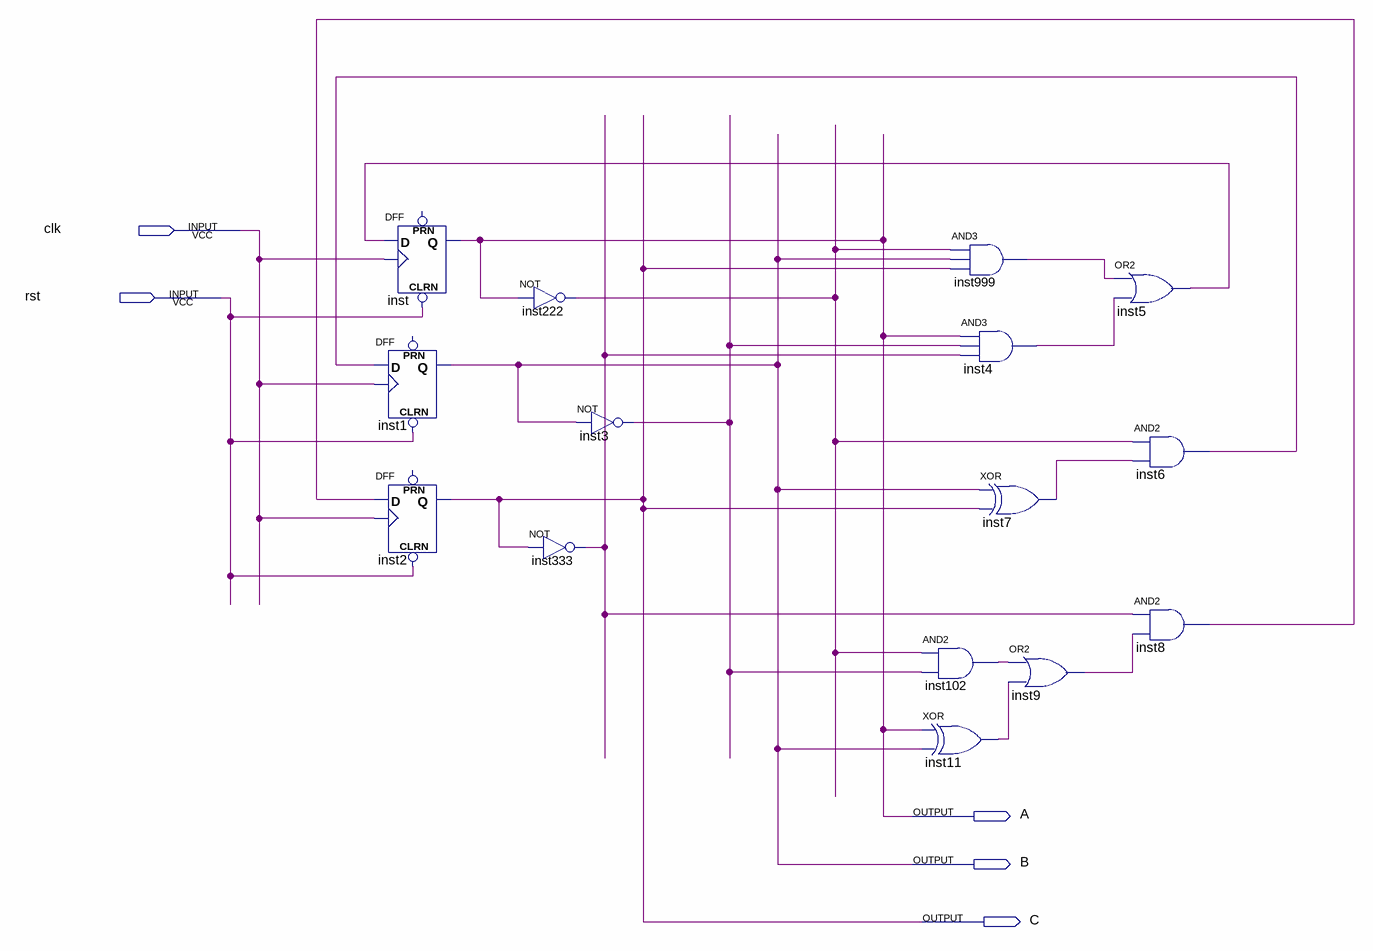
[diagram p0: schematic sheet]
// Quartus schematic count_6.bdf as structural Verilog: 15 symbols, 5 pins
module count_6 (
  input  clk,
  input  rst,
  output A,
  output B,
  output C
);

  wire inst3_out, inst4_out, inst5_out, inst6_out, inst7_out, inst8_out, inst9_out, inst11_out, inst102_out,
       inst222_out, inst333_out, inst999_out;

  DFF inst (.CLRN(rst), .CLK(clk), .D(inst5_out), .Q(A));  // open: PRN
  DFF inst1 (.CLRN(rst), .CLK(clk), .D(inst6_out), .Q(B));  // open: PRN
  DFF inst2 (.CLRN(rst), .CLK(clk), .D(inst8_out), .Q(C));  // open: PRN
  not inst222 (inst222_out, A);
  not inst3 (inst3_out, B);
  not inst333 (inst333_out, C);
  and inst999 (inst999_out, inst222_out, B, C);
  and inst4 (inst4_out, A, inst3_out, inst333_out);
  and inst102 (inst102_out, inst222_out, inst3_out);
  xor inst11 (inst11_out, A, B);
  xor inst7 (inst7_out, B, C);
  or inst9 (inst9_out, inst102_out, inst11_out);
  or inst5 (inst5_out, inst999_out, inst4_out);
  and inst6 (inst6_out, inst222_out, inst7_out);
  and inst8 (inst8_out, inst333_out, inst9_out);
endmodule
